# EAGLE design HP03S_HIH6130 (EAGLE 6.3)
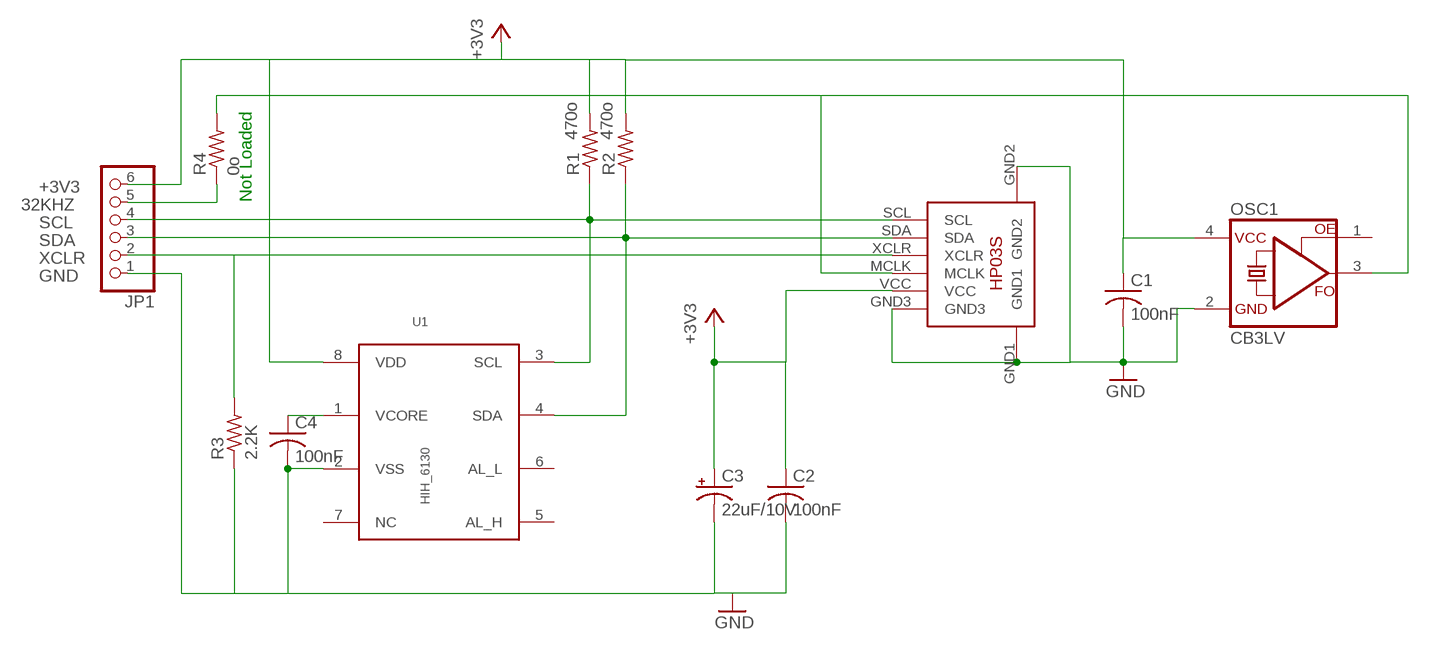
[diagram p0: schematic, sheet 1]

## Parts
C1  100nF  C-USC0805  [C0805]
C2  100nF  C-USC0805K  [C0805K]
C3  22uF/10V  CPOL-USSMCB  [SMC_B]
C4  100nF  C-USC0805K  [C0805K]
JP1  PINHD-1X6  [1X06]
OSC1  CB3LV  [SMD7.5X5MM]
R1  470o  R-US_R0603  [R0603]
R2  470o  R-US_R0603  [R0603]
R3  2.2K  R-US_R0603  [R0603]
R4  0o  R-US_R0603  [R0603]
U1  HIH_6130  [SOIC8]
U2  HP03S  [HP03S]

## Nets
32KHZ: JP1.5 R4.1
+3V3: C1.1 C2.1 C3.+ JP1.6 OSC1.4(VCC) R1.2 R2.2 U1.8(VDD) U2.VCC
GND: C1.2 C2.2 C3.- C4.2 JP1.1 OSC1.2(GND) R3.1 U1.2(VSS) U2.GND1 U2.GND2 U2.GND3
N$1: C4.1 U1.1(VCORE)
RTCCLK: OSC1.3(FO) R4.2 U2.MCLK
SCL: JP1.4 R1.1 U1.3(SCL) U2.SCL
SDA: JP1.3 R2.1 U1.4(SDA) U2.SDA
XCLR: JP1.2 R3.2 U2.XCLR
Unconnected: OSC1.1(OE) U1.5(AL_H) U1.6(AL_L) U1.7(NC)

## Notes on the sheet
- Not Loaded

## Library data of the parts
C1 C2 C4 = rcl:C-US: CAPACITOR, American symbol
C3 = rcl:CPOL-US: POLARIZED CAPACITOR, American symbol
JP1 = Headers:PINHD-1X6: PIN HEADER
OSC1 = crystal:CB3LV
R1-R4 = rcl:R-US_: RESISTOR, American symbol
U1 = Stofer:HIH_6130
U2 = HopeRF:HP03S

## Board
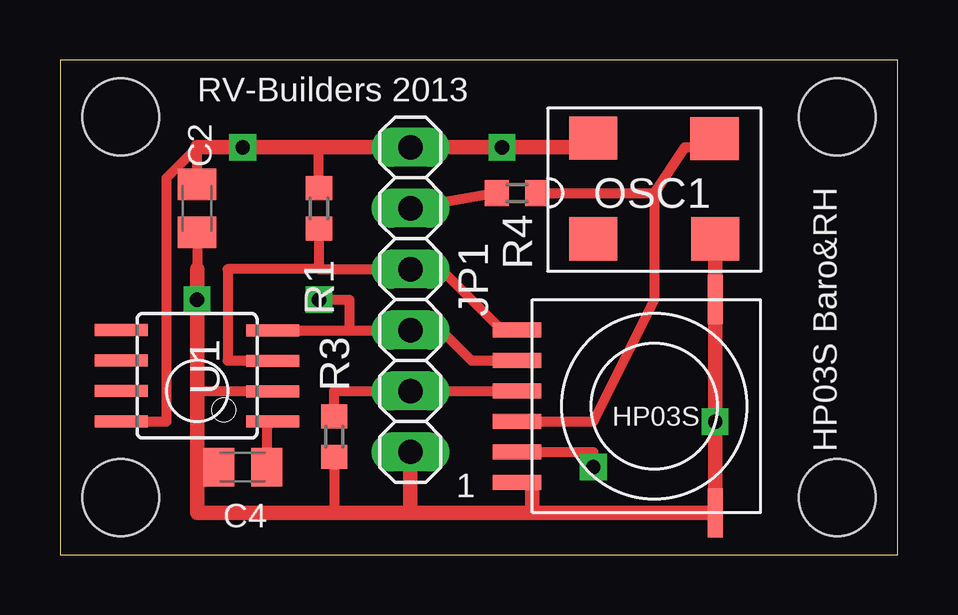
[diagram p1: board, top side]
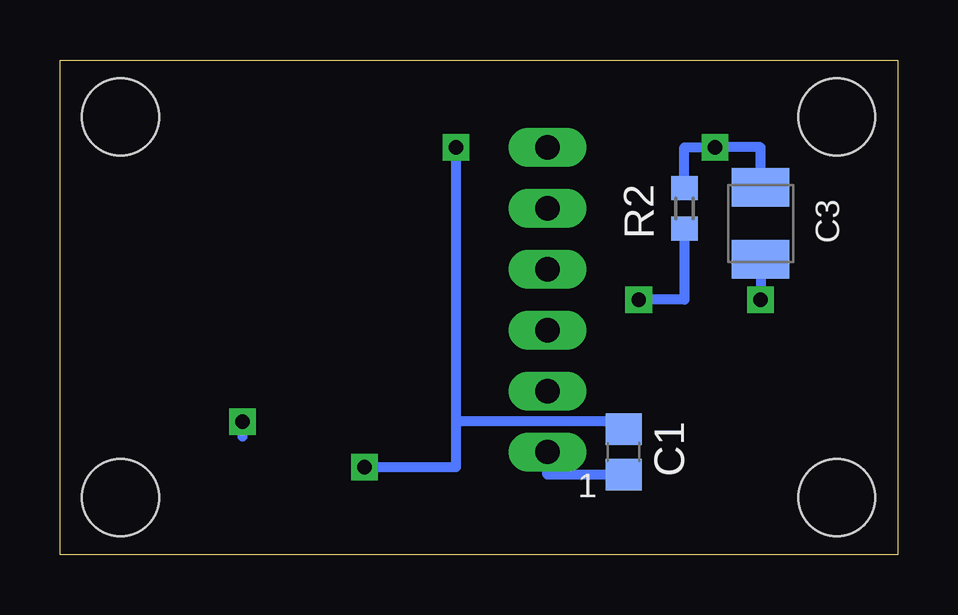
[diagram p2: board, bottom side, seen from below]

Size 34.91 x 20.62 mm. Coordinates in mm from the lower left corner, seen from the top.
Outline: 0,0 34.91,0 34.91,20.62 0,20.62 0,0
Copper layers (1*16): Top 0.035mm / dielectric 1.5mm / Bottom 0.035mm
Design rules "sparkfun": minimum track width 8mil, minimum drill 20mil, track to track 8mil, track to pad 8mil, pad to pad 8mil, via to via 8mil, smd to smd 8mil, copper to edge 10mil, drill to drill 8mil, minimum pad ring 12mil, minimum via ring 10mil, stop-mask expansion 4mil, vias tented up to drill 25mil, thermal gap 10mil
Holes 3.2 mm at 2.54,18.25 32.38,2.38 32.38,18.25 2.54,2.38

### Footprints (pad centres in the part's own frame; a part is rotated, then mirrored left to right if it is on the bottom)
C0805 = smd 1.3 x 1.5: 1 -0.95,0; 2 0.95,0
C0805K = smd 1.3 x 1.6: 1 -1,0; 2 1,0
SMC_B = smd 1.6 x 2.4: + -1.5,0; - 1.5,0
1X06 = drill 1.016 long: 1 -6.35,0; 2 -3.81,0; 3 -1.27,0; 4 1.27,0; 5 3.81,0; 6 6.35,0
SMD7.5X5MM = smd 2.007 x 1.803: 1 0,0; 2 5.08,0; 3 5.052,4.171; 4 0,4.191
R0603 = smd 1 x 1.1: 1 -0.85,0; 2 0.85,0
SOIC8 = smd 0.5 x 2.2: 1 -1.905,-3.154; 2 -0.645,-3.154; 3 0.625,-3.154; 4 1.895,-3.154; 5 1.905,3.154; 6 0.635,3.154; 7 -0.635,3.154; 8 -1.905,3.154
HP03S = smd 0.635 x 2.032: GND1 -7.62,7.62; GND2 -7.62,-1.27 | smd 2.032 x 0.635: GND3 0.635,6.35; MCLK 0.635,3.81; SCL 0.635,0; SDA 0.635,1.27; VCC 0.635,5.08; XCLR 0.635,2.54

### Placement (x,y rotation side)
C1  11.43,4.28 270 bottom
C2  5.71,14.44 270 top
C3  5.71,13.81 270 bottom
C4  7.62,3.64 180 top
JP1  14.6,10.63 90 top
OSC1  22.22,13.17 0 top
R1  10.79,14.44 90 top
R2  8.89,14.44 90 bottom
R3  11.43,4.92 90 top
R4  19.05,15.08 0 top
U1  5.71,7.46 90 top
U2  19.68,9.36 180 top

### Tracks (layer width: path | path; a pad name or v marks a point on that pad's centre or on a via)
32KHZ
  Top 0.406: R4.1 JP1.5
+3V3  (via drill 0.6)
  Top 0.406: JP1.6 13.33,16.98 | R1.2 10.79,16.98 | C2.1 5.71,16.98 4.44,15.71 4.44,5.55 U1.8 | 21.97,16.98 OSC1.4 22.47,16.73 22.47,16.98 v18.41,16.98 | U2.VCC 22.22,4.28 v22.22,3.64
  Top 0.61: 5.71,16.98 v7.62,16.98 10.79,16.98 JP1.6 v18.41,16.98 21.97,16.98
  Bottom 0.406: v18.41,16.98 18.41,5.55 | 18.41,5.55 18.41,3.64 v22.22,3.64 | C3.+ 5.71,16.98 v7.62,16.98 8.89,16.98 R2.2 | C1.1 11.75,5.55 18.41,5.55
GND  (via drill 0.6)
  Top 0.406: C2.2 5.71,11.9 | R3.1 11.43,1.74 | 5.71,6.81 U1.2 5.71,6.82 | C4.2 5.98,3.01 5.71,3.01
  Top 0.61: 14.6,1.74 11.43,1.74 5.71,1.74 5.71,3.01 5.71,6.81 5.71,6.82 v5.71,10.63 5.71,11.9 | 14.6,1.74 JP1.1 | OSC1.2 U2.GND2 v27.3,5.55 U2.GND1 19.68,1.74 | 14.6,1.74 19.68,1.74 | U2.GND3 19.68,3.01 19.68,1.74
  Bottom 0.406: 27.3,4.92 v27.3,5.55 | C3.- v5.71,10.63 | C1.2 14.6,3.33 JP1.1
N$1
  Top 0.406: U1.1 8.62,5.3 C4.1
RTCCLK
  Top 0.406: 27.27,17.01 OSC1.3 27,16.98 26.03,16.98 24.76,15.08 | U2.MCLK 22.22,5.55 24.76,10.63 24.76,15.08 | R4.2 24.76,15.08
SCL
  Top 0.406: 10.79,11.9 JP1.4 15.87,11.9 18.41,9.36 U2.SCL | R1.1 10.79,11.9 | 10.79,11.9 6.98,11.9 6.98,8.09 U1.3
SDA  (via drill 0.6)
  Top 0.406: U2.SDA 17.14,8.09 15.87,9.36 JP1.3 12.06,9.35 | U1.4 12.06,9.35 | v10.79,10.63 12.06,10.63 12.06,9.35
  Bottom 0.406: R2.1 8.89,10.63 v10.79,10.63
XCLR
  Top 0.406: R3.2 11.43,6.82 JP1.2 U2.XCLR

### Text on the board
tPlace: HP03S Baro&RH | 1
bPlace: 1
tNames: RV-Builders 2013